# Altium project LAB_COATING_MACHINE.dpf.PrjPcb
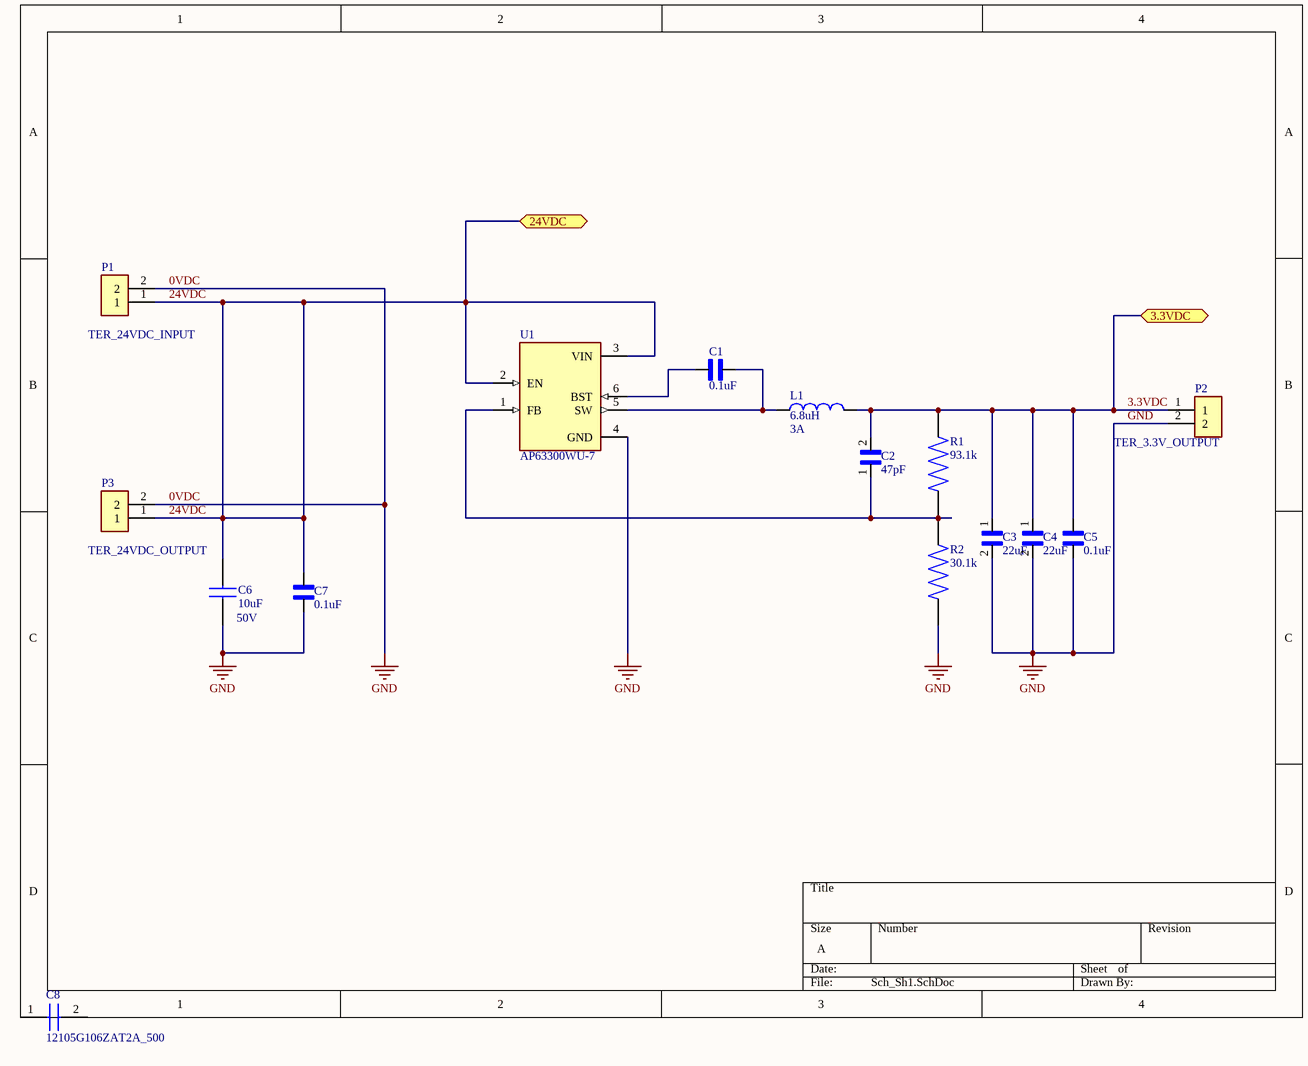
[diagram p0: Sch_Sh1.SchDoc]
3 sheets, 46 parts. Net scope: flat (ports and power ports of the same name join across sheets).
Board file: PCB1.PcbDoc
Sheets:
  Sch_Sh1.SchDoc
  Sch_Sh2.SchDoc
  Sch_Sh3.SchDoc

## Sheet Sch_Sh1.SchDoc
size A

### Parts
C1  0.1uF  [WCAP-CSGP_885012205086]
C2  47pF  [CAPC2012X145N]
C3  22uF  [CAPC2012X140N]
C4  22uF  [CAPC2012X140N]
C5  0.1uF  [WCAP-CSGP_885012205086]
C6  10uF  [CAPC3225X290N]
C7  0.1uF  [WCAP-CSGP_885012205086]
C8  12105G106ZAT2A_500  [CAPC3225X290N]
L1  6.8uH  [INDC3225X170N]
P1  Comment_1: TER_24VDC_INPUT  [TE_282837-2]  (hidden comment: 282837-2)
P2  Comment_1: TER_3.3V_OUTPUT  [TE_282837-2]  (hidden comment: 282837-2)
P3  Comment_1: TER_24VDC_OUTPUT  [TE_282837-2]  (hidden comment: 282837-2)
R1  93.1k  [RESC1005X40N]
R2  30.1k  [RES_ERJ2RKF3012X]
U1  AP63300WU-7  [SOT95P280X100-6N]

### Ports
3.3VDC, 24VDC

### Nets
0VDC: C3.2 C4.2 C5.1 C6.1 C7.1 P1.2 P2.2 P3.2 R2.1 U1.4(GND)  [also labelled GND]
3.3VDC: C2.2 C3.1 C4.1 C5.2 L1.2 P2.1 R1.2 ; port 3.3VDC
24VDC: C6.2 C7.2 P1.1 P3.1 U1.2(EN) U1.3(VIN) ; port 24VDC
NetC1_1: C1.1 L1.1 U1.5(SW)
NetC1_2: C1.2 U1.6(BST)
NetC2_1: C2.1 R1.1 R2.2 U1.1(FB)

Not connected (* = marked no-connect by the designer): C8 1 2

### Notes on the sheet
- (in symbol 12105G106ZAT2A_500) 50V
- (in symbol BRL3225T6R8M) 3A

### Library data of the parts
C1 C5 C7 = 885012205086: <b> WCAP-CSGP Ceramic Capacitors <br> <br> <br><b>Characteristics </b><br> </b><br>Multilayer Ceramic Chip Capacitor <br>Recommended soldering:Reflow, for 0603 and 0805 wave soldering is also allowed <br>Operating temperature:-55 Â°C to +125 Â°C; <br>Ceramic characteristics: Class I - NPO ; Class II -X7R, X5R <br>High performance ceramic <br>High capacitance stability <br>Minimal aging  <br>Termination:Cu/Ni/Sn <br>   <br><a href="http://katalog.we-online.de/media/images/eisos/WCAP-CSGP_pf2.jpg" title="Enlarge picture"> <img src="http://katalog.we-online.de/media/thumbs2/eisos/thb_WCAP-CSGP_pf2.jpg" width="320"></a><p> Details see: <a href="http://katalog.we-online.de/en/pbs/WCAP-CSGP-0402?">http://katalog.we-online.de/en/pbs/WCAP-CSGP-0402? </a><p>Created:  2015-01-28 <br>2015 (C) Wurth Elektronik; Package: None; Price: None; Value: *; MP: 885012205086; Availability: Unavailable
C2 = GRM21BC8YA106KE11L: SMD Capacitor X6S_EIA_ with Capacitance: 10uF Tol. 10%. Rated Voltage: 35Vdc; MF: Murata; MP: GRM21BC8YA106KE11L; Digi-Key_Purchase_URL: https://www.digikey.com/product-detail/en/murata-electronics/GRM21BC8YA106KE11L/490-10504-1-ND/5026432?utm_source=snapeda&utm_medium=aggregator&utm_campaign=symbol; SnapEDA_Link: https://www.snapeda.com/parts/GRM21BC8YA106KE11L/Murata/view-part/4383596/?ref=snap; Package: 2012 Murata; Value: *; Digi-Key_Part_Number: 490-10504-1-ND
C3 C4 = CL21A226MAQNNNE: 22ÂµF Â±20% 25V Ceramic Capacitor X5R 0805 (2012 Metric); MF: Samsung; SnapEDA_Link: https://www.snapeda.com/parts/CL21A226MAQNNNE/Samsung%20Electro-Mechanics/view-part/620487/?ref=snap; Check_prices: https://www.snapeda.com/parts/CL21A226MAQNNNE/Samsung%20Electro-Mechanics/view-part/620487/?ref=eda; Digi-Key_Part_Number: 1276-2908-1-ND; MP: CL21A226MAQNNNE; Value: *; Package: 0805 Samsung; Purchase-URL: https://pricing.snapeda.com/search/part/CL21A226MAQNNNE/?ref=eda
C6 = 12105G106ZAT2A_500: CAP CER 10UF 50V Y5V 1210; Manufacturer_Name: AVX; Manufacturer_Part_Number: 12105G106ZAT2A/500; Geometry.Height: 2.9mm; Mouser Part Number: *; Mouser Price/Stock: *; Arrow Part Number: *; Arrow Price/Stock: *; Datasheet Link: http://datasheets.avx.com/Y5V.pdf
C8 = 12105G106ZAT2A_500: Capacitor; Manufacturer_Name: AVX; Manufacturer_Part_Number: 12105G106ZAT2A/500; Datasheet Link: http://datasheets.avx.com/Y5V.pdf; Height: 2.9mm
L1 = BRL3225T6R8M: INDUCTOR, 6.8UH, 1.05A, +20%; Package: None; Price: None; Value: *; MP: BRL3225T6R8M; Availability: Unavailable
P1-P3 = 282837-2: Connector Terminal Blocks Receptacle 2 Position 5.08mm Solder Straight Thru-Hole 13.5A/Contact; MF: TE Connectivity; Check_prices: https://www.snapeda.com/parts/282837-2/TE+Connectivity+AMP+Connectors/view-part/?ref=eda; Value: *; Availability: In Stock; MP: 282837-2; Price: None; Package: None; SnapEDA_Link: https://www.snapeda.com/parts/282837-2/TE+Connectivity+AMP+Connectors/view-part/?ref=snap; Purchase-URL: https://pricing.snapeda.com/search/part/282837-2/?ref=eda
R1 = RC0402FR-0793K1L: Res Thick Film 0402 93.1K Ohm 1% 1/16W Â±100ppm/Â°C Molded SMD Paper T/R; Package: None; Price: None; Value: *; MP: RC0402FR-0793K1L; Availability: Unavailable
R2 = ERJ2RKF3012X: Price: None; MP: ERJ2RKF3012X; Package: None; Value: *; Availability: Unavailable
U1 = AP63300WU-7: Buck Switching Regulator IC Positive Adjustable 0.8V 1 Output 3A SOT-23-6 Thin, TSOT-23-6; MF: Diodes Incorporated; SnapEDA_Link: https://www.snapeda.com/parts/AP63300WU-7/Diodes%20Inc./view-part/4221814/?ref=snap; Availability: Unavailable; MP: AP63300WU-7; DigiKey-Purchase-URL: https://snapeda.com/shop?store=DigiKey&id=4221814; Price: None; Value: *; Package: SOT-23-6 Diodes Incorporated

## Sheet Sch_Sh2.SchDoc
size A
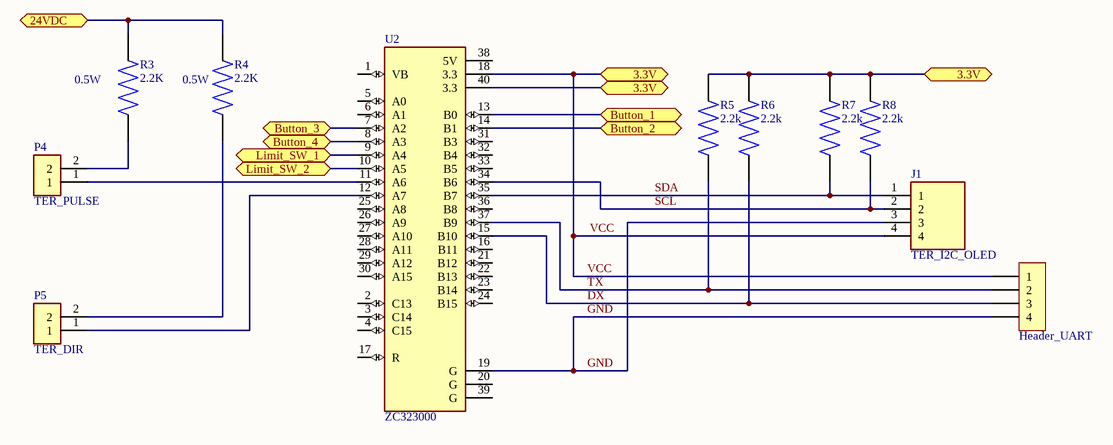
[diagram p1: Sch_Sh2.SchDoc]

### Parts
H1  Header_UART  [XH2.54M-4]
J1  Comment_1: TER_I2C_OLED  [TE_1546215-4]  (hidden comment: 1546215-4)
P4  Comment_1: TER_PULSE  [TE_282837-2]  (hidden comment: 282837-2)
P5  Comment_1: TER_DIR  [TE_282837-2]  (hidden comment: 282837-2)
R3  2.2K  [RES_ERJP06J202V]
R4  2.2K  [RES_ERJP06J202V]
R5  2.2k  [RES_ERJP06J202V]
R6  2.2k  [RES_ERJP06J202V]
R7  2.2k  [RES_ERJP06J202V]
R8  2.2k  [RES_ERJP06J202V]
U2  ZC323000  [MODULE_ZC323000]

### Ports
3.3V, 24VDC, Button_1, Button_2, Button_3, Button_4, Limit_SW_1, Limit_SW_2

### Nets
0VDC: U2.7(A2) U2.14(B1) ; port Button_2, port Button_3
24VDC: R3.2 R4.2 ; port 24VDC
DX: H1.3 R6.1 U2.15(B10)
GND: H1.4 J1.3 U2.19(G)
SCL: J1.2 R8.1 U2.34(B6)
SDA: J1.1 R7.1 U2.35(B7)
TX: H1.2 R5.1 U2.37(B9)
VCC: H1.1 J1.4 R5.2 R6.2 R7.2 R8.2 U2.18(3.3) U2.40(3.3) ; port 3.3V
NetC9_1: U2.13(B0) ; port Button_1
NetC12_1: U2.8(A3) ; port Button_4
NetP4_1: P4.1 U2.11(A6)
NetP4_2: P4.2 R3.1
NetP5_1: P5.1 U2.12(A7)
NetP5_2: P5.2 R4.1
NetR15_1: U2.9(A4) ; port Limit_SW_1
NetR16_1: U2.10(A5) ; port Limit_SW_2

Not connected (* = marked no-connect by the designer): U2 1(VB) 2(C13) 3(C14) 4(C15) 5(A0) 6(A1) 16(B11) 17(R) 20(G) 21(B12) 22(B13) 23(B14) 24(B15) 25(A8) 26(A9) 27(A10) 28(A11) 29(A12) 30(A15) 31(B3) 32(B4) 33(B5) 36(B8) 38(5V) 39(G)

### Notes on the sheet
- (in symbol ERJP06J202V) 0.5W

### Library data of the parts
H1 = Header 4P 2.54 Duc Thang: Cắm; Ten_Linh_Kien: Header 4P XH2.54-4P Đực Thẳng; Don_Vi: Con; Ma_Hang: MH001285; Chung_Loai: Cắm
J1 = 1546215-4: Conn Terminal Block 4 POS 2.54mm Solder ST Thru-Hole; MF: TE Connectivity; Check_prices: https://www.snapeda.com/parts/1546215-4/TE+Connectivity+AMP+Connectors/view-part/?ref=eda; Value: *; Availability: In Stock; MP: 1546215-4; Price: None; Package: None; SnapEDA_Link: https://www.snapeda.com/parts/1546215-4/TE+Connectivity+AMP+Connectors/view-part/?ref=snap; Purchase-URL: https://pricing.snapeda.com/search/part/1546215-4/?ref=eda
P4 P5 = 282837-2: as P1 on sheet Sch_Sh1; Check_prices: https://www.snapeda.com/parts/282837-2/TE+Connectivity+AMP+Connectors/view-part/?ref=eda; Value: *; Availability: In Stock; MP: 282837-2; Price: None; Package: None; SnapEDA_Link: https://www.snapeda.com/parts/282837-2/TE+Connectivity+AMP+Connectors/view-part/?ref=snap; Purchase-URL: https://pricing.snapeda.com/search/part/282837-2/?ref=eda
R3-R8 = ERJP06J202V: Value: *; Package: None; MP: ERJP06J202V; Price: None; Availability: Unavailable
U2 = ZC323000: STM32F103C8T6 ARM STM32 Minimum System Development Board Module For Arduino; Package: None; MP: ZC323000; Value: *; Availability: Unavailable; Price: None

## Sheet Sch_Sh3.SchDoc
size A
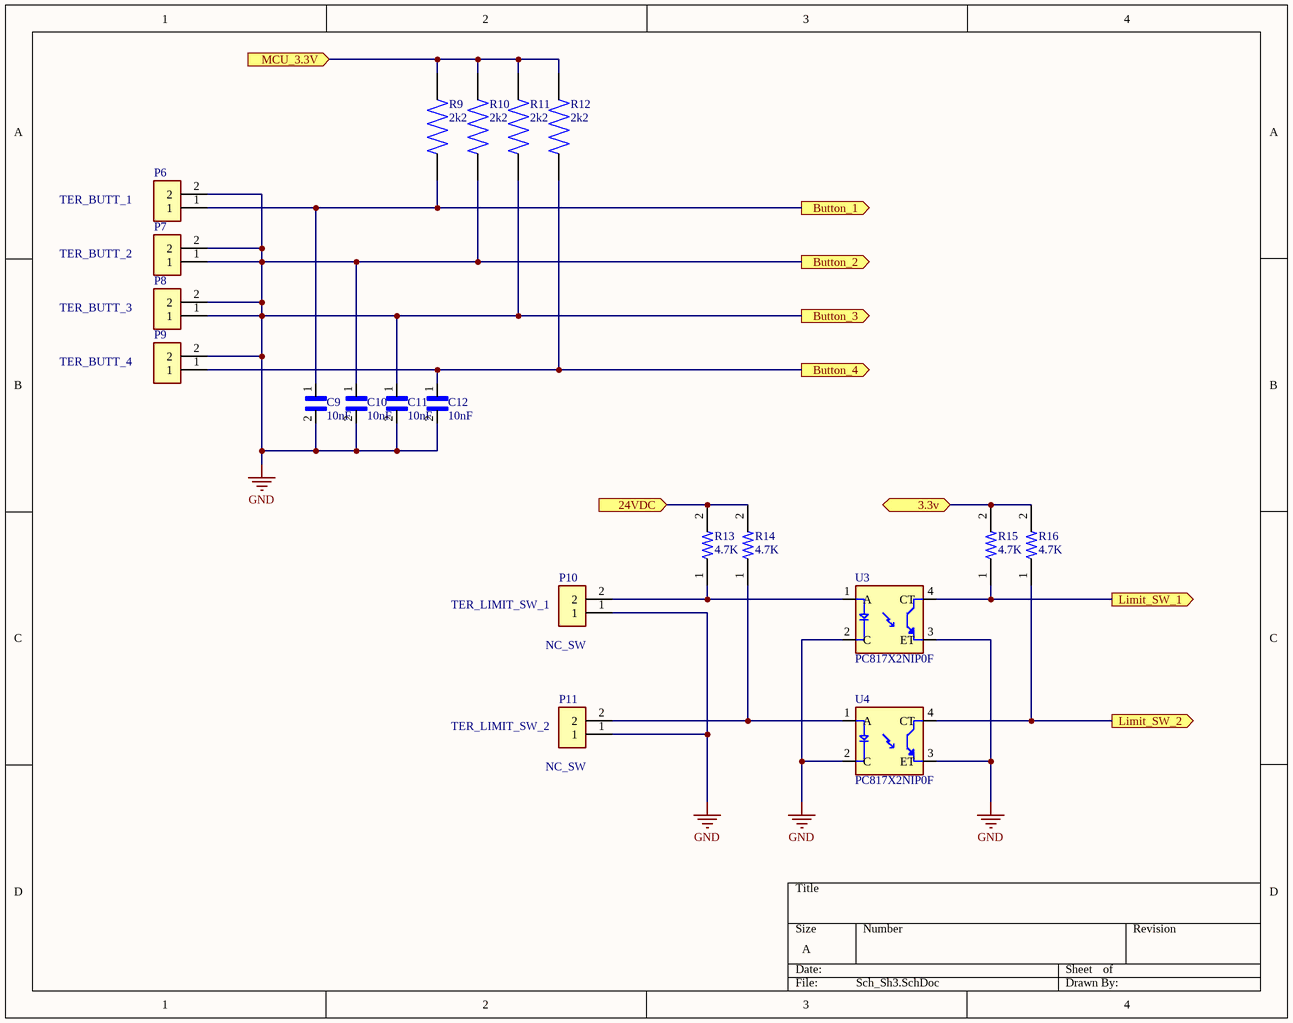
[diagram p2: Sch_Sh3.SchDoc]

### Parts
C9  10nF  [CAPC1005X55N]
C10  10nF  [CAPC1005X55N]
C11  10nF  [CAPC1005X55N]
C12  10nF  [CAPC1005X55N]
P6  Comment_1: TER_BUTT_1  [TE_282837-2]  (hidden comment: Button_1)
P7  Comment_1: TER_BUTT_2  [TE_282837-2]  (hidden comment: 282837-2)
P8  Comment_1: TER_BUTT_3  [TE_282837-2]  (hidden comment: 282837-2)
P9  Comment_1: TER_BUTT_4  [TE_282837-2]  (hidden comment: 282837-2)
P10  Comment_1: TER_LIMIT_SW_1  [TE_282837-2]  (hidden comment: 282837-2)
P11  Comment_1: TER_LIMIT_SW_2  [TE_282837-2]  (hidden comment: 282837-2)
R9  2k2  [RES_ERJ3EKF2201V]
R10  2k2  [RES_ERJ3EKF2201V]
R11  2k2  [RES_ERJ3EKF2201V]
R12  2k2  [RES_ERJ3EKF2201V]
R13  4.7K  [RESC1607X60N]
R14  4.7K  [RESC1607X60N]
R15  4.7K  [RESC1607X60N]
R16  4.7K  [RESC1607X60N]
U3  PC817X2NIP0F  [SOT254P975X400-4N]
U4  PC817X2NIP0F  [SOT254P975X400-4N]

### Ports
3.3v, 24VDC (in), Button_1 (out), Button_2 (out), Button_3 (out), Button_4 (out), Limit_SW_1 (out), Limit_SW_2 (out), MCU_3.3V (in)

### Nets
GND: C9.2 C10.1 C10.2 C11.1 C11.2 C12.2 P6.2 P7.1 P7.2 P8.1 P8.2 P9.2 P10.1 P11.1 R10.1 R11.1 U3.2(C) U3.3(ET) U4.2(C) U4.3(ET) ; port Button_2, port Button_3  [project net 0VDC]
24VDC: R13.2 R14.2 ; port 24VDC
VCC: R15.2 R16.2 ; port 3.3v
NetC9_1: C9.1 P6.1 R9.1 ; port Button_1
NetC12_1: C12.1 P9.1 R12.1 ; port Button_4
NetP10_2: P10.2 R13.1 U3.1(A)
NetP11_2: P11.2 R14.1 U4.1(A)
NetR9_2: R9.2 R10.2 R11.2 R12.2 ; port MCU_3.3V
NetR15_1: R15.1 U3.4(CT) ; port Limit_SW_1
NetR16_1: R16.1 U4.4(CT) ; port Limit_SW_2

### Notes on the sheet
- (in symbol 282837-2) NC_SW

### Library data of the parts
C9-C12 = CC0402KRX7R9BB103: 10000 pF Â±10% 50V Ceramic Capacitor X7R 0402 (1005 Metric); MF: Yageo; Purchase-URL: https://pricing.snapeda.com/search/part/CC0402KRX7R9BB103/?ref=eda; Package: 0402 Yageo; Value: *; Check_prices: https://www.snapeda.com/parts/CC0402KRX7R9BB103/Yageo/view-part/?ref=eda; SnapEDA_Link: https://www.snapeda.com/parts/CC0402KRX7R9BB103/Yageo/view-part/?ref=snap; Availability: In Stock; Price: None; MP: CC0402KRX7R9BB103
P6-P11 = 282837-2: as P1 on sheet Sch_Sh1; Check_prices: https://www.snapeda.com/parts/282837-2/TE+Connectivity+AMP+Connectors/view-part/?ref=eda; Value: *; Availability: In Stock; MP: 282837-2; Price: None; Package: None; SnapEDA_Link: https://www.snapeda.com/parts/282837-2/TE+Connectivity+AMP+Connectors/view-part/?ref=snap; Purchase-URL: https://pricing.snapeda.com/search/part/282837-2/?ref=eda
R9-R12 = ERJ3EKF2201V: 2.2 kOhms 1% 0.1W, 1/10W Chip Resistor 0603 (1608 Metric) Automotive AEC-Q200 Thick Film; MP: ERJ-3EKF2201V; MF: Panasonic; Value: *; Package: 1608-2 Panasonic; Check_prices: https://www.snapeda.com/parts/ERJ-3EKF2201V/Panasonic%20Electronic%20Components/view-part/371927/?ref=eda; Digi-Key_Part_Number: P2.20KHCT-ND; SnapEDA_Link: https://www.snapeda.com/parts/ERJ-3EKF2201V/Panasonic%20Electronic%20Components/view-part/371927/?ref=snap
R13-R16 = RC0603FR-074K7L: 4.7 kOhms Â±1% 0.1W, 1/10W Chip Resistor 0603 _1608 Metric_ Moisture Resistant Thick Film; MF: Yageo; Value: *; SnapEDA_Link: https://www.snapeda.com/parts/RC0603FR-074K7L/Yageo/view-part/473520/?ref=snap; MP: RC0603FR-074K7L; Availability: Unavailable; Price: None; Package: 0603 Yageo
U3 U4 = PC817X2NIP0F: Optoisolator Transistor Output 5000Vrms 1 Channel 4-SMD; MF: Sharp Microelectronics; Value: *; SnapEDA_Link: https://www.snapeda.com/parts/PC817X2NIP0F/Sharp+Microelectronics/view-part/?ref=snap; Purchase-URL: https://pricing.snapeda.com/search/part/PC817X2NIP0F/?ref=eda; Check_prices: https://www.snapeda.com/parts/PC817X2NIP0F/Sharp+Microelectronics/view-part/?ref=eda; Digi-Key_Part_Number: 425-2192-2-ND; Package: SMD-4 Sharp; MP: PC817X2NIP0F

## Nets that join several sheets
0VDC: Sch_Sh1 (10 pins), Sch_Sh2 (U2.7 U2.14), Sch_Sh3 (20 pins)
24VDC: Sch_Sh1 (6 pins), Sch_Sh2 (R3.2 R4.2), Sch_Sh3 (R13.2 R14.2)
NetC9_1: Sch_Sh2 (U2.13), Sch_Sh3 (C9.1 P6.1 R9.1)
NetC12_1: Sch_Sh2 (U2.8), Sch_Sh3 (C12.1 P9.1 R12.1)
NetR15_1: Sch_Sh2 (U2.9), Sch_Sh3 (R15.1 U3.4)
NetR16_1: Sch_Sh2 (U2.10), Sch_Sh3 (R16.1 U4.4)
VCC: Sch_Sh2 (8 pins), Sch_Sh3 (R15.2 R16.2)